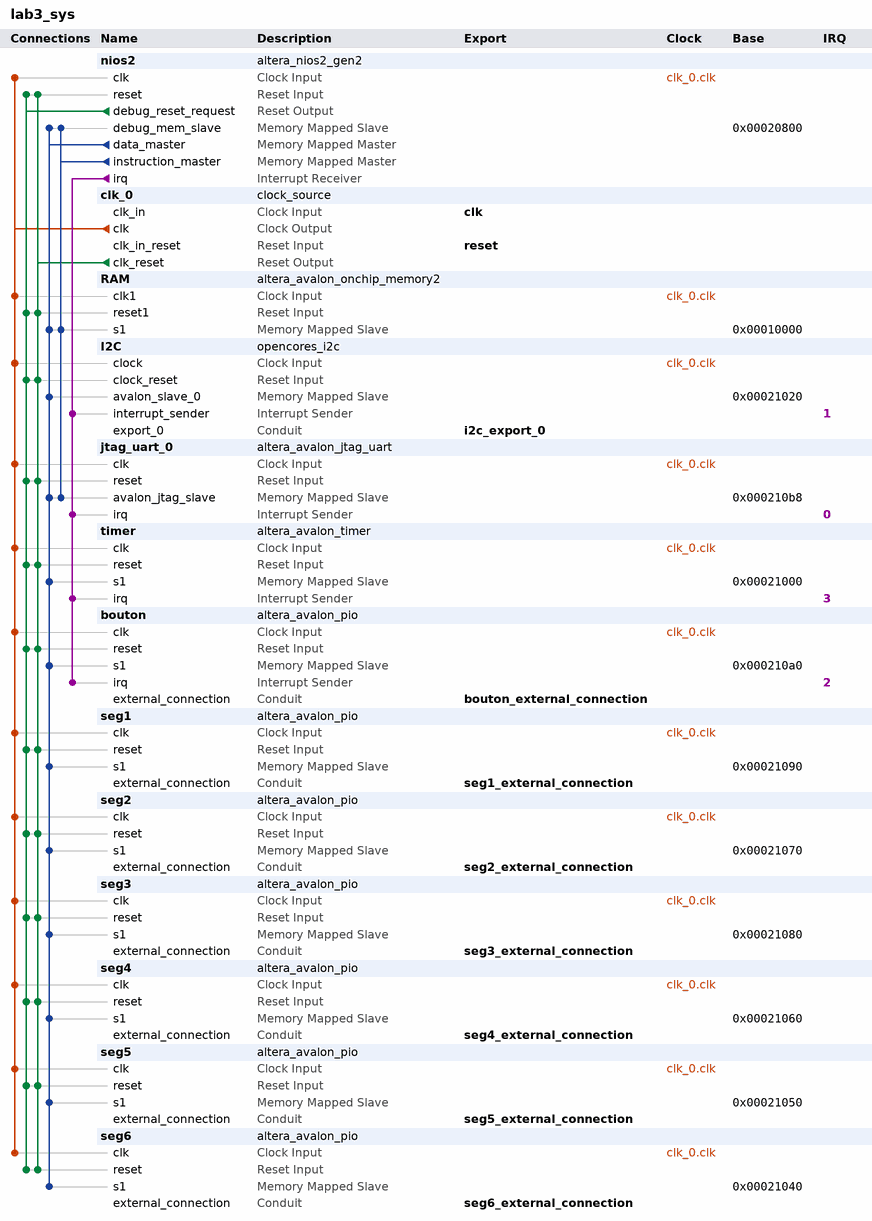
[diagram p0: system contents]
# Platform Designer (Qsys) system lab3_sys, MAX 10 10M50DAF484C6GES
# Parameters at their usual value, and those the tool derives, are not listed.
package require -exact qsys 18.1
create_system lab3_sys
set_project_property DEVICE_FAMILY {MAX 10}
set_project_property DEVICE 10M50DAF484C6GES

add_instance nios2 altera_nios2_gen2 18.1
set_instance_parameter_value nios2 dcache_size 2048
set_instance_parameter_value nios2 exceptionSlave RAM.s1
set_instance_parameter_value nios2 icache_size 4096
set_instance_parameter_value nios2 impl Tiny
set_instance_parameter_value nios2 resetSlave RAM.s1

add_instance clk_0 clock_source 18.1
set_instance_parameter_value clk_0 clockFrequency 50000000

add_instance RAM altera_avalon_onchip_memory2 18.1
set_instance_parameter_value RAM dataWidth 32
set_instance_parameter_value RAM dualPort false
set_instance_parameter_value RAM initMemContent false
set_instance_parameter_value RAM initializationFileName onchip_mem.hex
set_instance_parameter_value RAM memorySize 40960

add_instance I2C opencores_i2c 9.1

add_instance jtag_uart_0 altera_avalon_jtag_uart 18.1
set_instance_parameter_value jtag_uart_0 simInteractiveOptions NO_INTERACTIVE_WINDOWS

add_instance timer altera_avalon_timer 18.1
set_instance_parameter_value timer period 1
set_instance_parameter_value timer periodUnits SEC

add_instance bouton altera_avalon_pio 18.1
set_instance_parameter_value bouton captureEdge true
set_instance_parameter_value bouton direction Input
set_instance_parameter_value bouton edgeType FALLING
set_instance_parameter_value bouton generateIRQ true
set_instance_parameter_value bouton irqType EDGE
set_instance_parameter_value bouton width 1

add_instance seg1 altera_avalon_pio 18.1
set_instance_parameter_value seg1 direction Output
set_instance_parameter_value seg1 width 7

add_instance seg2 altera_avalon_pio 18.1
set_instance_parameter_value seg2 direction Output
set_instance_parameter_value seg2 width 7

add_instance seg3 altera_avalon_pio 18.1
set_instance_parameter_value seg3 direction Output
set_instance_parameter_value seg3 width 7

add_instance seg4 altera_avalon_pio 18.1
set_instance_parameter_value seg4 direction Output
set_instance_parameter_value seg4 width 7

add_instance seg5 altera_avalon_pio 18.1
set_instance_parameter_value seg5 direction Output
set_instance_parameter_value seg5 width 7

add_instance seg6 altera_avalon_pio 18.1
set_instance_parameter_value seg6 direction Output
set_instance_parameter_value seg6 width 7

# connections
add_connection clk_0.clk bouton.clk clock
add_connection clk_0.clk I2C.clock clock
add_connection clk_0.clk jtag_uart_0.clk clock
add_connection clk_0.clk nios2.clk clock
add_connection clk_0.clk RAM.clk1 clock
add_connection clk_0.clk seg1.clk clock
add_connection clk_0.clk seg2.clk clock
add_connection clk_0.clk seg3.clk clock
add_connection clk_0.clk seg4.clk clock
add_connection clk_0.clk seg5.clk clock
add_connection clk_0.clk seg6.clk clock
add_connection clk_0.clk timer.clk clock
add_connection clk_0.clk_reset bouton.reset reset
add_connection clk_0.clk_reset I2C.clock_reset reset
add_connection clk_0.clk_reset jtag_uart_0.reset reset
add_connection clk_0.clk_reset nios2.reset reset
add_connection clk_0.clk_reset RAM.reset1 reset
add_connection clk_0.clk_reset seg1.reset reset
add_connection clk_0.clk_reset seg2.reset reset
add_connection clk_0.clk_reset seg3.reset reset
add_connection clk_0.clk_reset seg4.reset reset
add_connection clk_0.clk_reset seg5.reset reset
add_connection clk_0.clk_reset seg6.reset reset
add_connection clk_0.clk_reset timer.reset reset
add_connection nios2.debug_reset_request bouton.reset reset
add_connection nios2.debug_reset_request I2C.clock_reset reset
add_connection nios2.debug_reset_request jtag_uart_0.reset reset
add_connection nios2.debug_reset_request nios2.reset reset
add_connection nios2.debug_reset_request RAM.reset1 reset
add_connection nios2.debug_reset_request seg1.reset reset
add_connection nios2.debug_reset_request seg2.reset reset
add_connection nios2.debug_reset_request seg3.reset reset
add_connection nios2.debug_reset_request seg4.reset reset
add_connection nios2.debug_reset_request seg5.reset reset
add_connection nios2.debug_reset_request seg6.reset reset
add_connection nios2.debug_reset_request timer.reset reset
add_connection nios2.data_master bouton.s1 avalon
set_connection_parameter_value nios2.data_master/bouton.s1 baseAddress 0x000210a0
add_connection nios2.data_master I2C.avalon_slave_0 avalon
set_connection_parameter_value nios2.data_master/I2C.avalon_slave_0 baseAddress 0x00021020
add_connection nios2.data_master jtag_uart_0.avalon_jtag_slave avalon
set_connection_parameter_value nios2.data_master/jtag_uart_0.avalon_jtag_slave baseAddress 0x000210b8
add_connection nios2.data_master nios2.debug_mem_slave avalon
set_connection_parameter_value nios2.data_master/nios2.debug_mem_slave baseAddress 0x00020800
add_connection nios2.data_master RAM.s1 avalon
set_connection_parameter_value nios2.data_master/RAM.s1 baseAddress 0x00010000
add_connection nios2.data_master seg1.s1 avalon
set_connection_parameter_value nios2.data_master/seg1.s1 baseAddress 0x00021090
add_connection nios2.data_master seg2.s1 avalon
set_connection_parameter_value nios2.data_master/seg2.s1 baseAddress 0x00021070
add_connection nios2.data_master seg3.s1 avalon
set_connection_parameter_value nios2.data_master/seg3.s1 baseAddress 0x00021080
add_connection nios2.data_master seg4.s1 avalon
set_connection_parameter_value nios2.data_master/seg4.s1 baseAddress 0x00021060
add_connection nios2.data_master seg5.s1 avalon
set_connection_parameter_value nios2.data_master/seg5.s1 baseAddress 0x00021050
add_connection nios2.data_master seg6.s1 avalon
set_connection_parameter_value nios2.data_master/seg6.s1 baseAddress 0x00021040
add_connection nios2.data_master timer.s1 avalon
set_connection_parameter_value nios2.data_master/timer.s1 baseAddress 0x00021000
add_connection nios2.instruction_master jtag_uart_0.avalon_jtag_slave avalon
set_connection_parameter_value nios2.instruction_master/jtag_uart_0.avalon_jtag_slave baseAddress 0x000210b8
add_connection nios2.instruction_master nios2.debug_mem_slave avalon
set_connection_parameter_value nios2.instruction_master/nios2.debug_mem_slave baseAddress 0x00020800
add_connection nios2.instruction_master RAM.s1 avalon
set_connection_parameter_value nios2.instruction_master/RAM.s1 baseAddress 0x00010000
add_connection nios2.irq bouton.irq interrupt
set_connection_parameter_value nios2.irq/bouton.irq irqNumber 2
add_connection nios2.irq I2C.interrupt_sender interrupt
set_connection_parameter_value nios2.irq/I2C.interrupt_sender irqNumber 1
add_connection nios2.irq jtag_uart_0.irq interrupt
set_connection_parameter_value nios2.irq/jtag_uart_0.irq irqNumber 0
add_connection nios2.irq timer.irq interrupt
set_connection_parameter_value nios2.irq/timer.irq irqNumber 3

# exported interfaces
add_interface bouton_external_connection conduit end
set_interface_property bouton_external_connection EXPORT_OF bouton.external_connection
add_interface clk clock sink
set_interface_property clk EXPORT_OF clk_0.clk_in
add_interface i2c_export_0 conduit end
set_interface_property i2c_export_0 EXPORT_OF I2C.export_0
add_interface reset reset sink
set_interface_property reset EXPORT_OF clk_0.clk_in_reset
add_interface seg1_external_connection conduit end
set_interface_property seg1_external_connection EXPORT_OF seg1.external_connection
add_interface seg2_external_connection conduit end
set_interface_property seg2_external_connection EXPORT_OF seg2.external_connection
add_interface seg3_external_connection conduit end
set_interface_property seg3_external_connection EXPORT_OF seg3.external_connection
add_interface seg4_external_connection conduit end
set_interface_property seg4_external_connection EXPORT_OF seg4.external_connection
add_interface seg5_external_connection conduit end
set_interface_property seg5_external_connection EXPORT_OF seg5.external_connection
add_interface seg6_external_connection conduit end
set_interface_property seg6_external_connection EXPORT_OF seg6.external_connection

set_interconnect_requirement {$system} qsys_mm.clockCrossingAdapter HANDSHAKE
set_interconnect_requirement {$system} qsys_mm.enableEccProtection FALSE
set_interconnect_requirement {$system} qsys_mm.insertDefaultSlave FALSE
set_interconnect_requirement {$system} qsys_mm.maxAdditionalLatency 1

save_system lab3_sys.qsys
